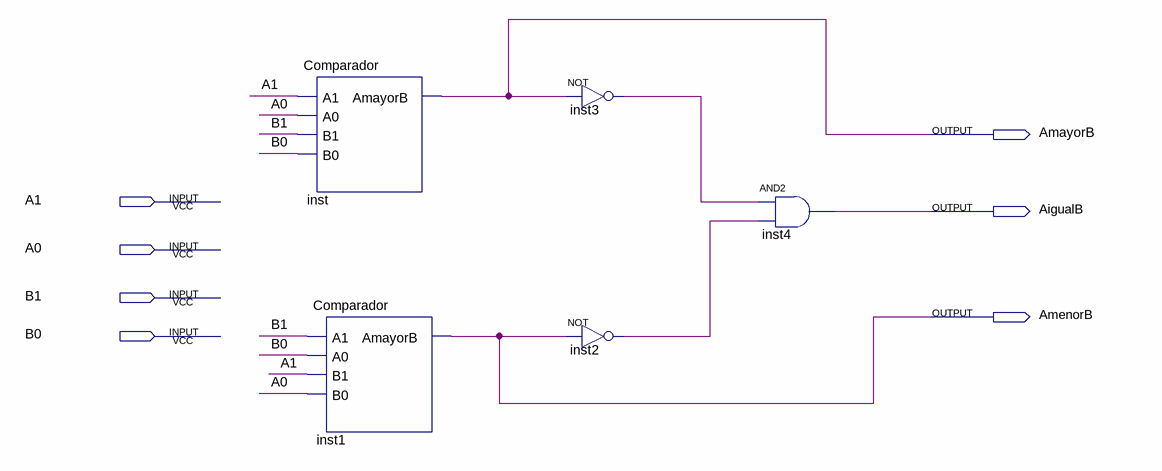
[diagram p0: schematic sheet]
// Quartus schematic Pract2.bdf as structural Verilog: 5 symbols, 7 pins
module Pract2 (
  input  A1,
  input  A0,
  input  B1,
  input  B0,
  output AmayorB,
  output AigualB,
  output AmenorB
);

  wire inst2_out, inst3_out;

  Comparador inst (.A1(A1), .A0(A0), .B1(B1), .B0(B0), .AmayorB(AmayorB));
  Comparador inst1 (.A1(B1), .A0(B0), .B1(A1), .B0(A0), .AmayorB(AmenorB));
  not inst3 (inst3_out, AmayorB);
  not inst2 (inst2_out, AmenorB);
  and inst4 (AigualB, inst3_out, inst2_out);
endmodule
